# EAGLE design LEDDimmerI2C_RevB (EAGLE 6.4)
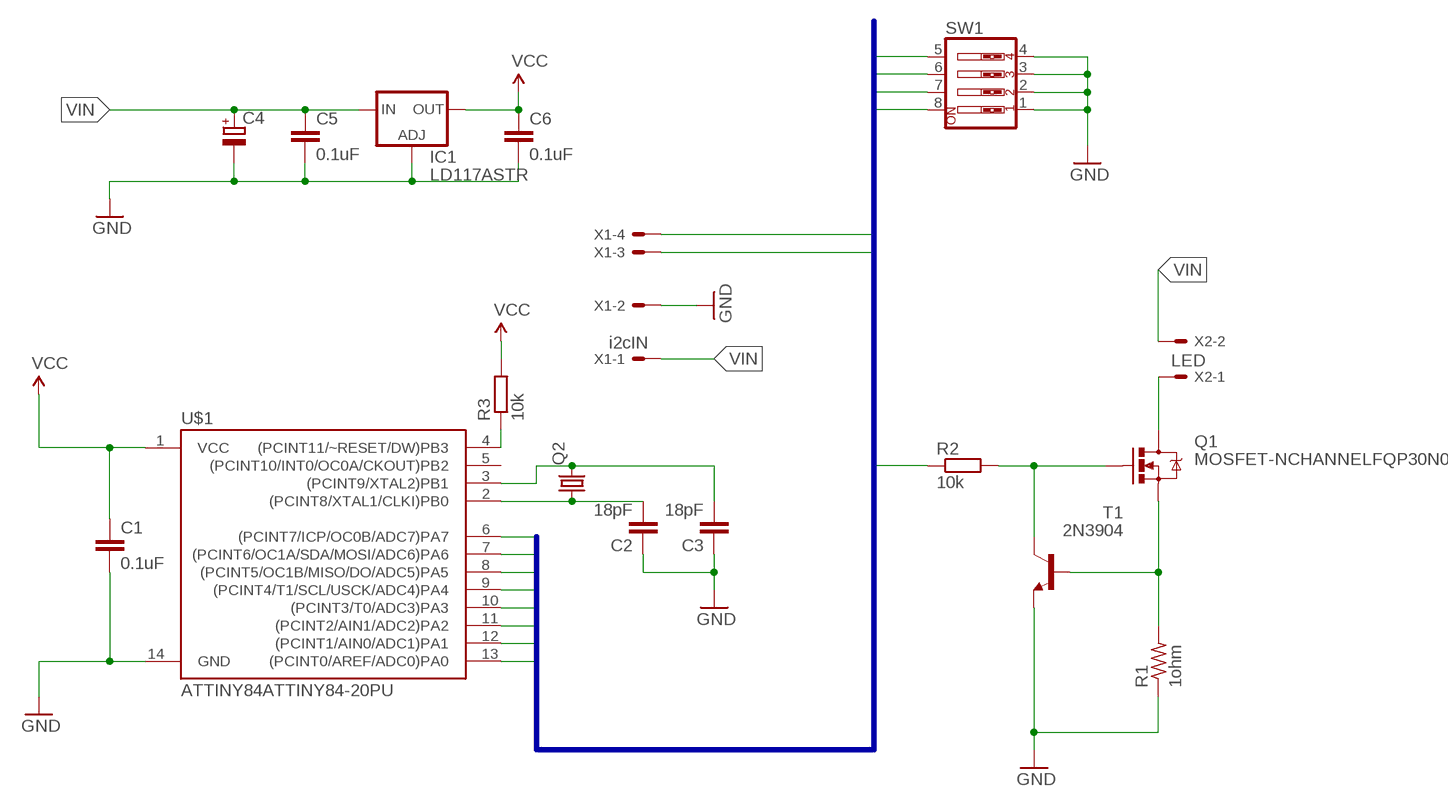
[diagram p0: schematic, sheet 1]

## Parts
C1  0.1uF  CAP0805  [0805]
C2  18pF  CAP0805  [0805]
C3  18pF  CAP0805  [0805]
C4  CPOL-EUE3.5-10  [E3,5-10]
C5  0.1uF  CAP0805  [0805]
C6  0.1uF  CAP0805  [0805]
IC1  LD117ASTR  [SOT223]
Q1  MOSFET-NCHANNELFQP30N06L  [TO220V]
Q2  CRYSTALSM49  [SM49]
R1  1ohm  R-US_VTA54  [VTA54]
R2  10k  R-EU_R0805  [R0805]
R3  10k  R-EU_R0805  [R0805]
SW1  SW_DIP-4  [EDG-04]
T1  2N3904  [TO92]
U$1  ATTINY84ATTINY84-20PU  [DIL14]
X1  i2cIN  22-23-2041  [22-23-2041]
X2  LED  22-23-2021  [22-23-2021]

## Nets
GND: C1.2 C2.1 C3.1 C4.- C5.2 C6.2 IC1.1(ADJ) R1.1 SW1.1 SW1.2 SW1.3 SW1.4 T1.3(E) U$1.14(GND) X1.2
N$1: Q1.1(G) R2.2 T1.1(C)
N$2: R3.1 U$1.4((PCINT11/~RESET/DW)PB3)
N$3: C3.2 Q2.2 U$1.3((PCINT9/XTAL2)PB1)
N$4: C2.2 Q2.1 U$1.2((PCINT8/XTAL1/CLKI)PB0)
N$5: Q1.3(S) R1.2 T1.2(B)
N$6: Q1.2(D) X2.1
PORTA0: SW1.5 U$1.13((PCINT0/AREF/ADC0)PA0)
PORTA1: SW1.6 U$1.12((PCINT1/AIN0/ADC1)PA1)
PORTA2: SW1.7 U$1.11((PCINT2/AIN1/ADC2)PA2)
PORTA3: SW1.8 U$1.10((PCINT3/T0/ADC3)PA3)
PORTA4: U$1.9((PCINT4/T1/SCL/USCK/ADC4)PA4) X1.4
PORTA5: R2.1 U$1.8((PCINT5/OC1B/MISO/DO/ADC5)PA5)
PORTA6: U$1.7((PCINT6/OC1A/SDA/MOSI/ADC6)PA6) X1.3
PORTA7: U$1.6((PCINT7/ICP/OC0B/ADC7)PA7)
VCC: C1.1 C6.1 IC1.4(OUT) R3.2 U$1.1(VCC)
VIN: C4.+ C5.1 IC1.3(IN) X1.1 X2.2
Unconnected: U$1.5((PCINT10/INT0/OC0A/CKOUT)PB2)

## Buses
PORTA[0..7]

## Library data of the parts
C1-C3 C5 C6 = SparkFun-Capacitors:CAP: Capacitor Standard 0603 ceramic capacitor, and 0.1" leaded capacitor.
C4 = rcl:CPOL-EU: POLARIZED CAPACITOR, European symbol
IC1 = v-reg:LD117A?*: Low drop fixed and adjustable positive voltage regulators 1 A Source: http://www.st.com/stonline/products/literature/ds/7194/ld1117axx.pdf
Q1 = SparkFun-DiscreteSemi:MOSFET-NCHANNEL: Common NMOSFET Parts MFG P/N Store ID Prod ID FDD8780 TRANS-09984 SI7820DN TRANS-11055 FDS6630A IC-08089 2N7002PW TRANS-11151 FQP30N06L COM-10213 TRANS-10060 BSS123LT1G TRANS-08345 BSS138 TRANS-00830 BS170 2N7000; PROD_ID: TRANS-10060
Q2 = adafruit:CRYSTAL: CRYSTAL; OC_FARNELL: unknown; OC_NEWARK: unknown
R1 = rcl:R-US_: RESISTOR, American symbol
R2 R3 = rcl:R-EU_: RESISTOR, European symbol
SW1 = special:SW_DIP-4: DIP SWITCH
T1 = transistor:2N3904: NPN TRANSISTOR
U$1 = SparkFun-DigitalIC:ATTINY84: Atmel 14-pin 2/4/8kB flash uC
X1 = con-molex:22-23-2041: .100" (2.54mm) Center Header - 4 Pin; MF: MOLEX; MPN: 22-23-2041; OC_FARNELL: 1462920; OC_NEWARK: 38C0355
X2 = con-molex:22-23-2021: .100" (2.54mm) Center Header - 2 Pin; MF: MOLEX; MPN: 22-23-2021; OC_FARNELL: 1462926; OC_NEWARK: 25C3832

## Net classes
0 default: width 0.762 mm, clearance 0.762 mm

## Board
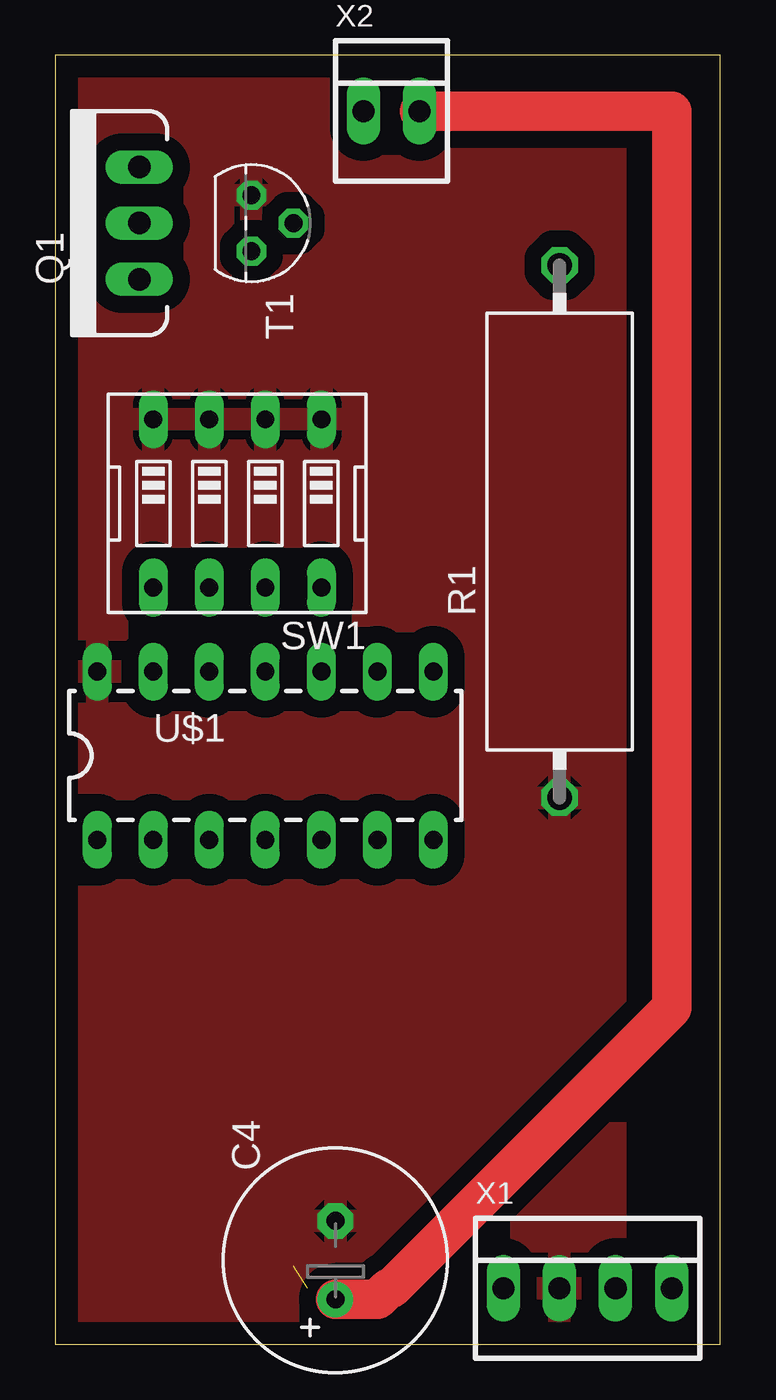
[diagram p1: board, top side]
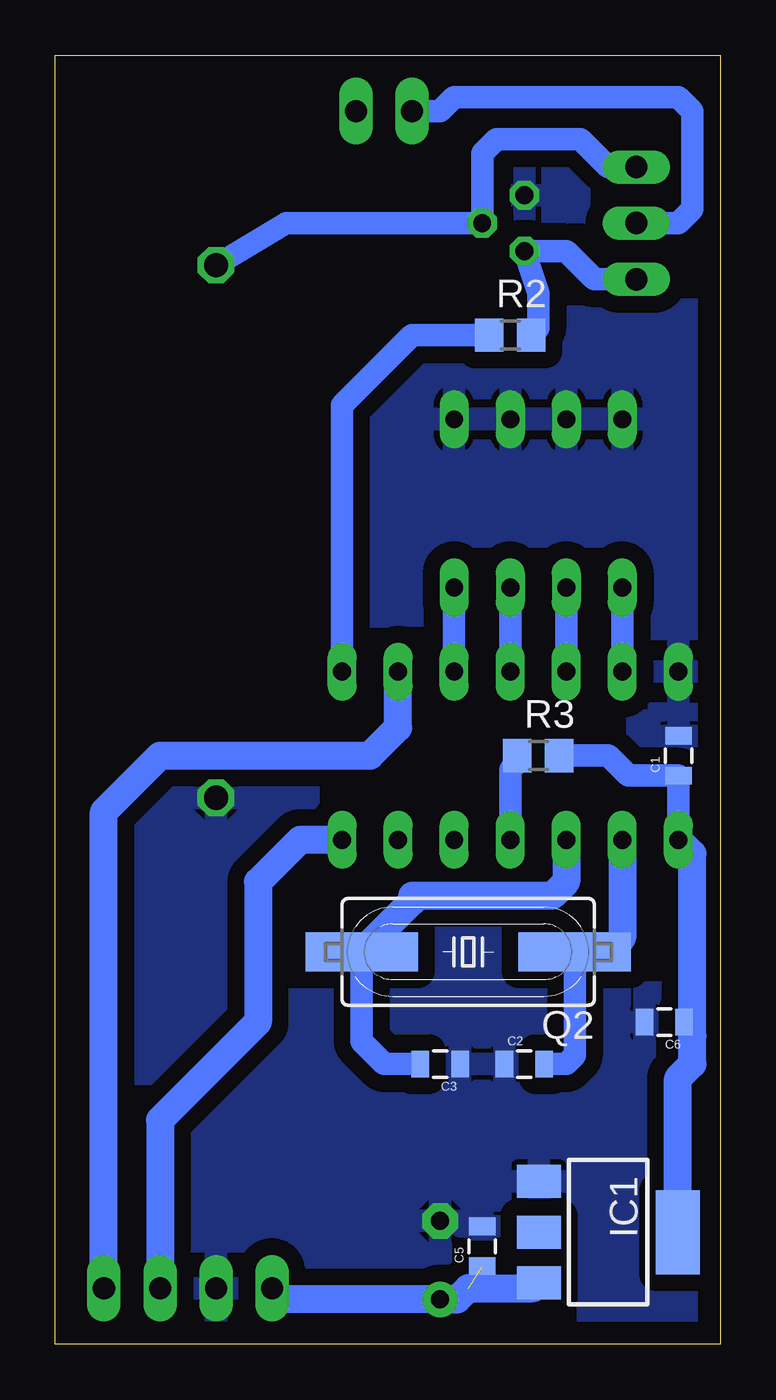
[diagram p2: board, bottom side, seen from below]

Size 30.15 x 58.41 mm. Coordinates in mm from the lower left corner, seen from the top.
Outline: 0,0 30.15,0 30.15,58.41 0,58.41 0,0
Copper layers (1*16): Top 0.035mm / dielectric 1.5mm / Bottom 0.035mm
Design rules "default": minimum track width 10mil, minimum drill 24mil, track to track 8mil, track to pad 8mil, pad to pad 8mil, via to via 8mil, smd to smd 8mil, copper to edge 40mil, drill to drill 8mil, minimum pad ring 10mil, minimum via ring 8mil, stop-mask expansion 4mil, vias tented up to drill 0mil, thermal gap 10mil

### Footprints (pad centres in the part's own frame; a part is rotated, then mirrored left to right if it is on the bottom)
0805 = smd 0.8 x 1.2: 1 -0.9,0; 2 0.9,0
E3,5-10 = drill 0.813 pad 1.6: + -1.778,0 | drill 0.813 pad 1.6 octagon: - 1.778,0
SOT223 = smd 1.5 x 2: 1 -2.3,-3.15; 2 0,-3.15; 3 2.3,-3.15 | smd 3.8 x 2: 4 0,3.15
TO220V = drill 1.016 long: 1 -2.54,0; 2 0,0; 3 2.54,0
SM49 = smd 5.08 x 1.778: 1 -4.826,0; 2 4.826,0
VTA54 = drill 1.1 octagon: 1 -12.065,0; 2 12.065,0
R0805 = smd 1.3 x 1.5: 1 -0.95,0; 2 0.95,0
EDG-04 = drill 0.813 long: 1 -3.81,-3.81; 2 -1.27,-3.81; 3 1.27,-3.81; 4 3.81,-3.81; 5 3.81,3.81; 6 1.27,3.81; 7 -1.27,3.81; 8 -3.81,3.81
TO92 = drill 0.813 octagon: 1 1.27,0; 2 0,1.905; 3 -1.27,0
DIL14 = drill 0.813 long: 1 -8.89,-3.81; 2 -6.35,-3.81; 3 -3.81,-3.81; 4 -1.27,-3.81; 5 1.27,-3.81; 6 3.81,-3.81; 7 6.35,-3.81; 8 6.35,3.81; 9 3.81,3.81; 10 1.27,3.81; 11 -1.27,3.81; 12 -3.81,3.81; 13 -6.35,3.81; 14 -8.89,3.81
22-23-2041 = drill 1 long: 1 -3.81,0; 2 -1.27,0; 3 1.27,0; 4 3.81,0
22-23-2021 = drill 1 long: 1 -1.27,0; 2 1.27,0

### Placement (x,y rotation side)
C1  1.91,26.67 90 bottom
C2  8.89,12.7 0 bottom
C3  12.7,12.7 180 bottom
C4  12.7,3.81 90 top
C5  10.79,4.45 90 bottom
C6  2.54,14.61 180 bottom
IC1  5.08,5.08 270 bottom
Q1  3.81,50.8 90 top
Q2  11.43,17.78 180 bottom
R1  22.86,36.83 90 top
R2  9.53,45.72 0 bottom
R3  8.26,26.67 0 bottom
SW1  8.26,38.1 180 top
T1  8.89,50.8 270 top
U$1  10.79,26.67 0 top
X1  24.13,2.54 0 top
X2  15.24,55.88 0 top

### Tracks (layer width: path | path; a pad name or v marks a point on that pad's centre or on a via)
GND
  pour Top: 0,58.42 25.4,58.42 25.4,0 0,0
  pour Bottom: 0,58.42 30.48,58.42 30.48,0 0,0
N$1
  Bottom 1.016: R2.2 8.26,46.04 8.26,47.62 T1.1 6.99,49.53 5.71,48.26 Q1.1
N$2
  Bottom 1.016: R3.1 9.21,26.36 9.53,26.04 U$1.4
N$3
  Bottom 0.406: 13.97,12.7 C3.2
  Bottom 1.016: Q2.2 16.26,13.72 15.24,12.7 13.97,12.7
  Bottom 1.27: U$1.3 6.99,20.95 7.62,20.32 13.97,20.32 13.97,20.07 Q2.2
N$4
  Bottom 0.406: 7.62,12.7 C2.2
  Bottom 1.016: Q2.1 6.6,13.08 6.99,12.7 7.62,12.7
  Bottom 1.27: U$1.2 4.45,18.41 5.08,17.78 Q2.1
N$5
  Bottom 1.016: R1.2 19.68,50.8 T1.2 10.79,53.98 10.16,54.61 6.35,54.61 5.08,53.34 Q1.3
N$6
  Bottom 1.016: Q1.2 1.91,50.8 1.27,51.44 1.27,55.88 1.91,56.52 12.06,56.52 12.7,55.88 X2.1
PORTA0
  Bottom 1.016: SW1.5 U$1.13
PORTA1
  Bottom 1.016: SW1.6 U$1.12
PORTA2
  Bottom 1.016: SW1.7 U$1.11
PORTA3
  Bottom 1.016: SW1.8 U$1.10
PORTA4
  Bottom 1.27: X1.4 27.94,24.13 25.4,26.67 15.88,26.67 14.61,27.94 U$1.9
PORTA5
  Bottom 1.016: U$1.8 17.14,42.55 13.97,45.72 R2.1
PORTA6
  Bottom 1.27: U$1.7 19.05,22.86 20.95,20.95 20.95,14.61 25.4,10.16 X1.3
VCC
  Bottom 0.254: C6.1 1.64,14.34 1.27,13.97
  Bottom 1.016: U$1.1 C1.1 4.18,25.77 5.08,26.67 R3.2
  Bottom 1.27: IC1.4 1.93,12.04 1.27,12.7 1.27,13.97 1.27,22.23 U$1.1
VIN  (1 unrouted)
  Top 1.778: X2.2 27.94,55.88 27.94,15.24 15.24,2.54 15.11,2.54 14.61,2.03 C4.+
  Bottom 1.27: IC1.3 8.47,2.54 11.43,2.54 11.94,2.03 C4.+ 19.81,2.03 X1.1